# Altium project 5A.PrjPcb
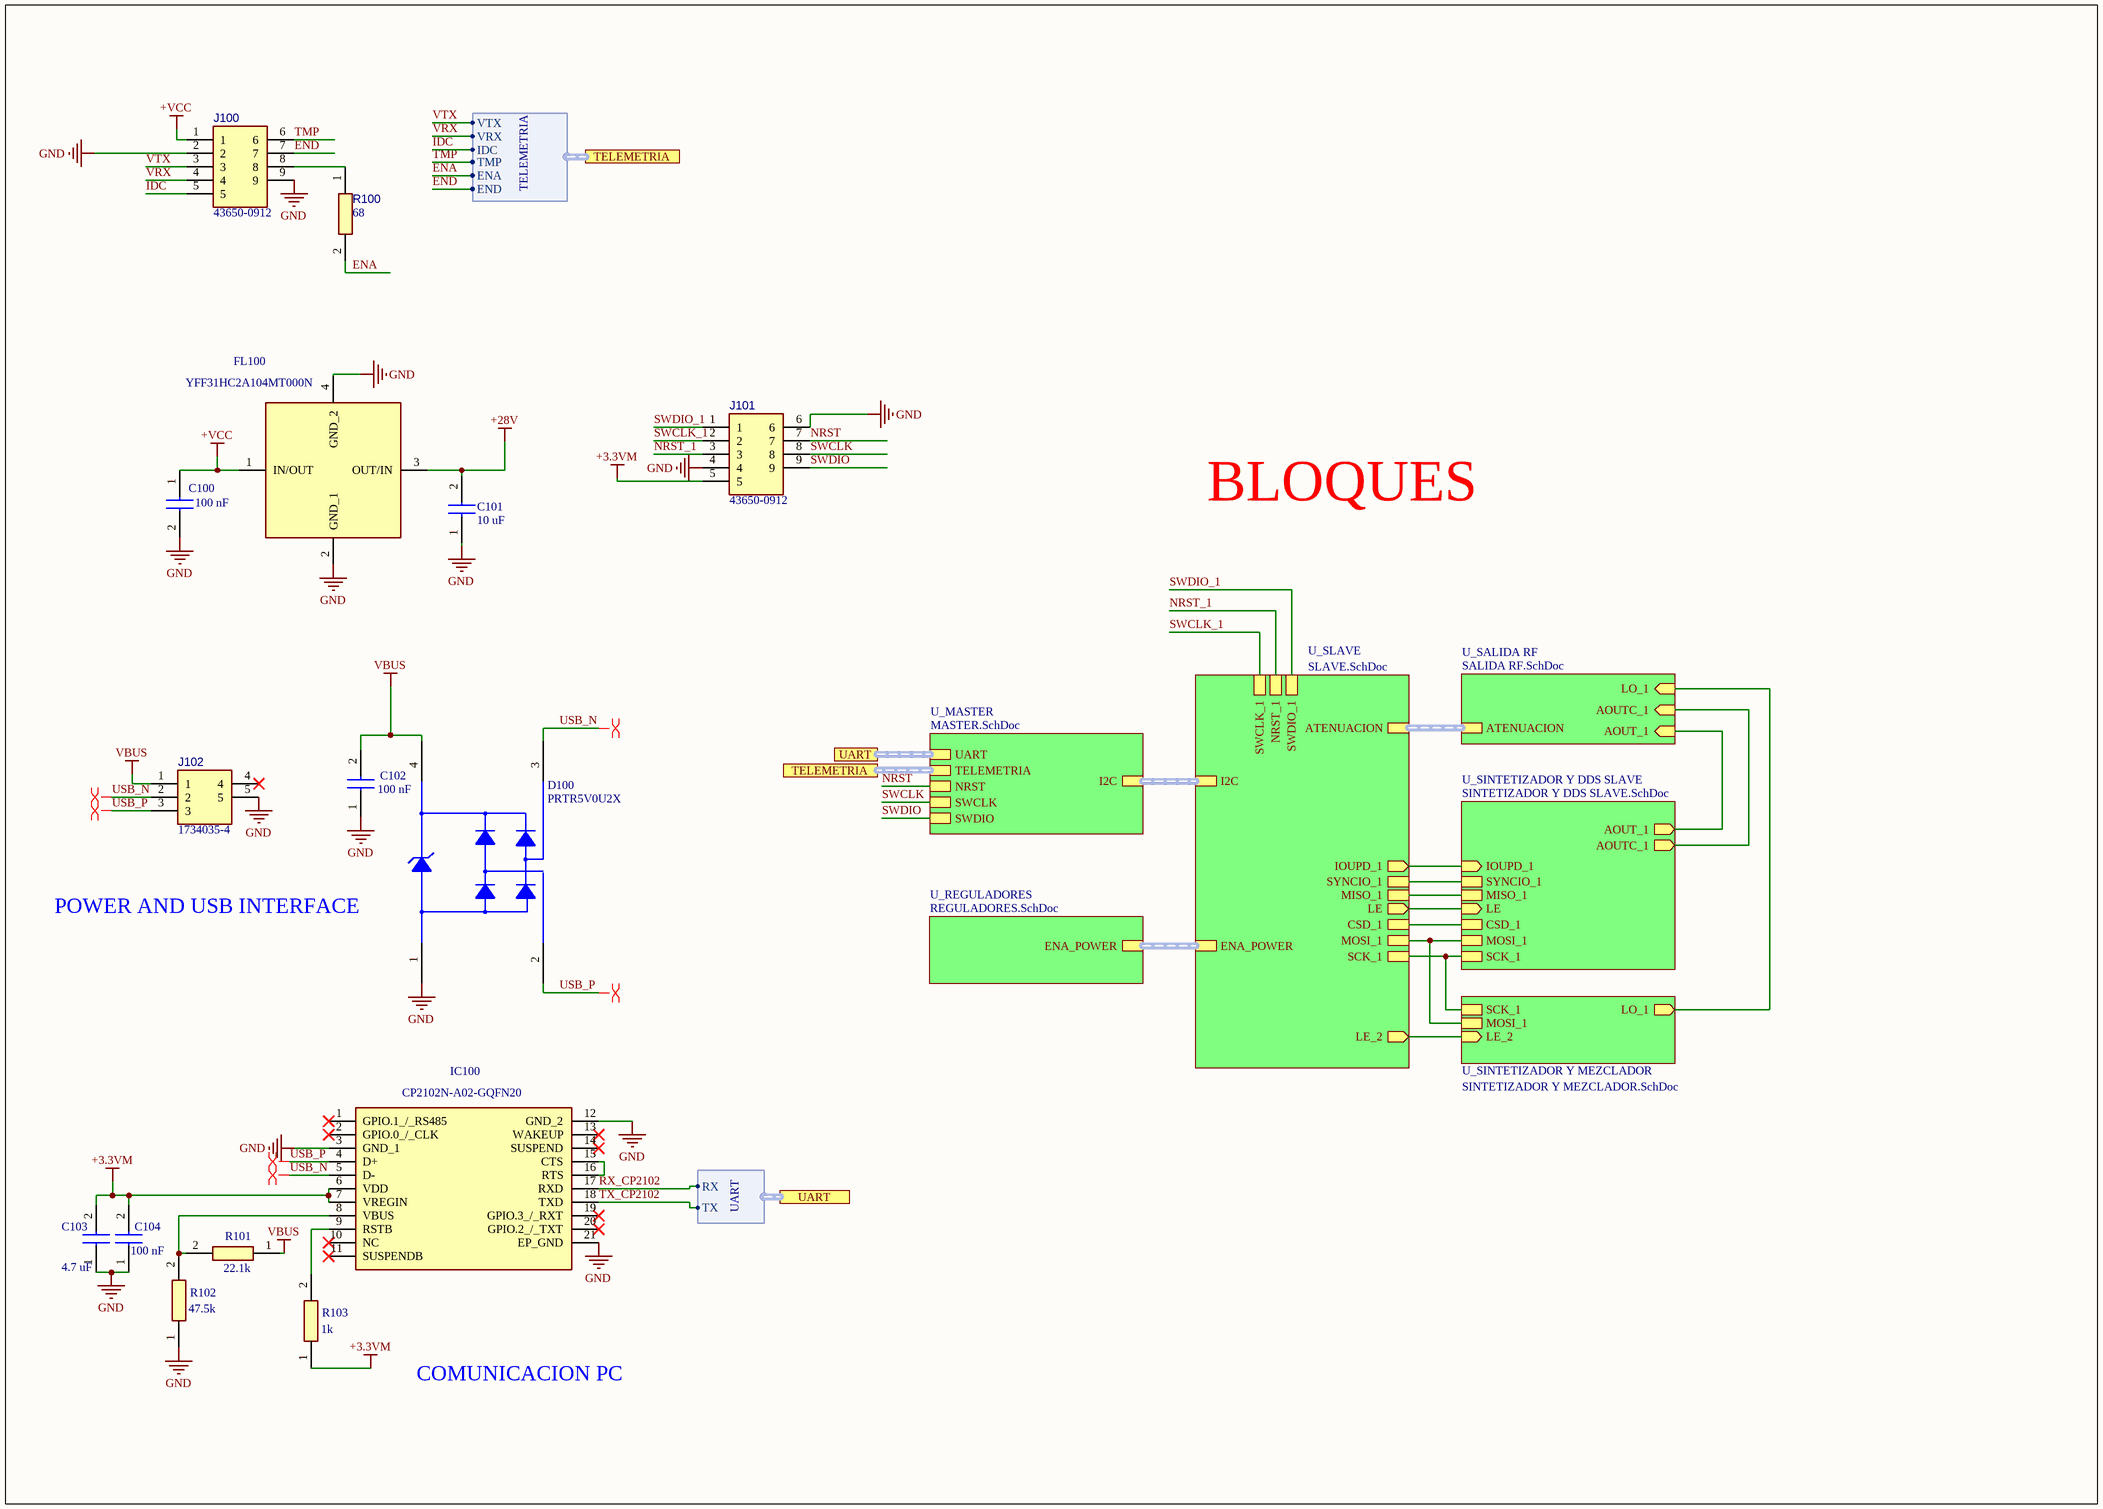
[diagram p0: GENERADORA V1.5.SchDoc]
5 sheets, 145 parts. Net scope: hierarchical (ports join the sheet entries above them; power ports are global).
Board file: GENERADORA V1.5.PcbDoc
Sheets:
  GENERADORA V1.5.SchDoc
    U_SALIDA RF = SALIDA RF.SchDoc
    U_SINTETIZADOR Y DDS SLAVE = SINTETIZADOR Y DDS SLAVE.SchDoc
    U_SINTETIZADOR Y MEZCLADOR = SINTETIZADOR Y MEZCLADOR.SchDoc
    U_SLAVE = SLAVE.SchDoc

## Sheet GENERADORA V1.5.SchDoc
size A3; SheetNumber: 1; SheetTotal: 7

### Parts
C100  100 nF  [CAPC3216X94N]
C101  10 uF  [CAPC3216X94N]
C102  100 nF  [CAPC3216X94N]
C103  4.7 uF  [C0603]
C104  100 nF  [C0603]
D100  PRTR5V0U2X  [AP4-00001]
FL100  YFF31HC2A104MT000N  [YFF31HC2A104MT000N]
IC100  CP2102N-A02-GQFN20  [CP2102NA02GQFN20]
J100  43650-0912  [43650-09(12,13,14)]
J101  43650-0912  [43650-09(12,13,14)]
J102  1734035-4  [1734035-2USB]
R100  68  [RESC1608X55N]
R101  22.1k  [RESC1608X55N]
R102  47.5k  [RESC1608X55N]
R103  1k  [RESC1608X55N]

### Sub-sheets
U_MASTER = MASTER.SchDoc (file not in this document): I2C (harness I2C), UART (harness UART), TELEMETRIA (harness TELEMETRIA), NRST, SWCLK, SWDIO
U_REGULADORES = REGULADORES.SchDoc (file not in this document): ENA_POWER (harness ENA_POWER)
U_SALIDA RF = SALIDA RF.SchDoc: LO_1 (in), AOUTC_1 (in), AOUT_1 (in), ATENUACION (harness ATENUACION)
U_SINTETIZADOR Y DDS SLAVE = SINTETIZADOR Y DDS SLAVE.SchDoc: AOUTC_1 (out), AOUT_1 (out), CSD_1, SCK_1, MISO_1, SYNCIO_1, MOSI_1, LE (in), IOUPD_1 (in)
U_SINTETIZADOR Y MEZCLADOR = SINTETIZADOR Y MEZCLADOR.SchDoc: SCK_1, MOSI_1, LE_2 (in), LO_1 (out)
U_SLAVE = SLAVE.SchDoc: IOUPD_1 (out), LE (out), LE_2 (out), I2C (harness I2C), ATENUACION (harness ATENUACION), SWCLK_1, SWDIO_1, NRST_1, ENA_POWER (harness ENA_POWER), CSD_1, MISO_1, MOSI_1, SCK_1, SYNCIO_1

### Ports
TELEMETRIA (harness TELEMETRIA), UART (harness TELEMETRIA), UART (harness UART)

### Harnesses
UART: RX, TX
TELEMETRIA: VTX, VRX, IDC, TMP, ENA, END

### Nets
+3.3VM: C103.2 C104.2 IC100.6(VDD) IC100.7(VREGIN) J101.5 R103.1
+28V: C101.2 FL100.3(OUT/IN)
+VCC: C100.1 FL100.1(IN/OUT) J100.1
GND: C100.2 C101.1 C102.1 C103.1 C104.1 D100.1(GND) FL100.2(GND_1) FL100.4(GND_2) IC100.3(GND_1) IC100.12(GND_2) IC100.21(EP_GND) J100.2 J100.9 J101.4 J101.6 J102.5 R102.1
VBUS: C102.2 D100.4(VCC) J102.1 R101.1
AOUT_1: sheet U_SALIDA RF/AOUT_1, sheet U_SINTETIZADOR Y DDS SLAVE/AOUT_1
AOUTC_1: sheet U_SALIDA RF/AOUTC_1, sheet U_SINTETIZADOR Y DDS SLAVE/AOUTC_1
CSD_1: sheet U_SINTETIZADOR Y DDS SLAVE/CSD_1, sheet U_SLAVE/CSD_1
ENA: R100.2 ; port TELEMETRIA.ENA
END: J100.7 ; port TELEMETRIA.END
IDC: J100.5 ; port TELEMETRIA.IDC
IOUPD_1: sheet U_SINTETIZADOR Y DDS SLAVE/IOUPD_1, sheet U_SLAVE/IOUPD_1
LE: sheet U_SINTETIZADOR Y DDS SLAVE/LE, sheet U_SLAVE/LE
LE_2: sheet U_SINTETIZADOR Y MEZCLADOR/LE_2, sheet U_SLAVE/LE_2
MISO_1: sheet U_SINTETIZADOR Y DDS SLAVE/MISO_1, sheet U_SLAVE/MISO_1
MOSI_1: sheet U_SINTETIZADOR Y DDS SLAVE/MOSI_1, sheet U_SINTETIZADOR Y MEZCLADOR/MOSI_1, sheet U_SLAVE/MOSI_1
NRST: J101.7 ; sheet U_MASTER/NRST
NRST_1: J101.3 ; sheet U_SLAVE/NRST_1
RX_CP2102: IC100.17(RXD) ; port UART.RX
SCK_1: sheet U_SINTETIZADOR Y DDS SLAVE/SCK_1, sheet U_SINTETIZADOR Y MEZCLADOR/SCK_1, sheet U_SLAVE/SCK_1
SWCLK: J101.8 ; sheet U_MASTER/SWCLK
SWCLK_1: J101.2 ; sheet U_SLAVE/SWCLK_1
SWDIO: J101.9 ; sheet U_MASTER/SWDIO
SWDIO_1: J101.1 ; sheet U_SLAVE/SWDIO_1
SYNCIO_1: sheet U_SINTETIZADOR Y DDS SLAVE/SYNCIO_1, sheet U_SLAVE/SYNCIO_1
TMP: J100.6 ; port TELEMETRIA.TMP
TX_CP2102: IC100.18(TXD) ; port UART.TX
USB_N: D100.3(I/O_2) IC100.5(D-) J102.2
USB_P: D100.2(I/O_1) IC100.4(D+) J102.3
VRX: J100.4 ; port TELEMETRIA.VRX
VTX: J100.3 ; port TELEMETRIA.VTX
NetC619_1: sheet U_SALIDA RF/LO_1, sheet U_SINTETIZADOR Y MEZCLADOR/LO_1
NetIC100_8: IC100.8(VBUS) R101.2 R102.2
NetIC100_9: IC100.9(RSTB) R103.2
NetIC100_15: IC100.15(CTS) IC100.16(RTS)
NetJ100_8: J100.8 R100.1

Not connected (* = marked no-connect by the designer): IC100 1(GPIO.1_/_RS485)* 2(GPIO.0_/_CLK)* 10(NC)* 11(SUSPENDB)* 13(WAKEUP)* 14(SUSPEND)* 19(GPIO.3_/_RXT)* 20(GPIO.2_/_TXT)*; J102 4*

### Buses and harness runs
harness port TELEMETRIA = sheet U_MASTER/TELEMETRIA
harness port UART = sheet U_MASTER/UART
harness sheet U_MASTER/I2C = sheet U_SLAVE/I2C
harness sheet U_REGULADORES/ENA_POWER = sheet U_SLAVE/ENA_POWER
harness sheet U_SALIDA RF/ATENUACION = sheet U_SLAVE/ATENUACION

### Layout directives
differential pair; differential pair class USB: USB_N, USB_P

### Notes on the sheet
- BLOQUES
- POWER AND USB INTERFACE
- COMUNICACION PC

### Library data of the parts
C100-C102 = KAM31BR81H103KT: Capacitor; Manufacturer_Name: KYOCERA; Datasheet Link: https://datasheets.kyocera-avx.com/AutoMLCCKAM.pdf; Height: 0.94mm; Manufacturer_Part_Number: KAM31BR81H103KT; Mouser Part Number: 581-KAM31BR81H103KT; Mouser Price/Stock: https://www.mouser.co.uk/ProductDetail/KYOCERA-AVX/KAM31BR81H103KT?qs=Jm2GQyTW%2FbjzijSUJGW%2FJA%3D%3D
C103 C104 = C0603H470J5GACTU: Capacitor; Manufacturer_Name: KEMET; Datasheet Link: https://content.kemet.com/datasheets/KEM_C1001_C0G_200C_SMD.pdf; Height: 0.87mm; Manufacturer_Part_Number: C0603H470J5GACTU
D100 = PRTR5V0U2X: Double rail-to-rail USB ESD protection diode; OrcadPartType: Integrated Circuits&Special function&Protection; Manufacturer: Philips; AN: A06-0236; TemperatureRange: -40 to +85 C; Value: PRTR5V0U2X; PartType: Buy; Height: 1,10000002384186; MPN: PRTR5V0U2X
FL100 = YFF31HC2A104MT000N: Filter; Manufacturer_Name: TDK; Datasheet Link: https://product.tdk.com/system/files/dam/doc/product/emc/emc/3tf/catalog/3tf_commercial_power_yff-hc_en.pdf; Height: 1.5mm; Manufacturer_Part_Number: YFF31HC2A104MT000N; Mouser Part Number: 810-YFF31HC2A104MTHN; Mouser Price/Stock: https://www.mouser.co.uk/ProductDetail/TDK/YFF31HC2A104MT000N?qs=1gGcJ6gR7Y2xnDLNcVCkdg%3D%3D; Arrow Part Number: YFF31HC2A104MT000N; Arrow Price/Stock: https://www.arrow.com/en/products/yff31hc2a104mt000n/tdk?region=nac
IC100 = CP2102N-A02-GQFN20: Integrated Circuit; Manufacturer_Name: Silicon Labs; Datasheet Link: https://www.silabs.com/documents/public/data-sheets/cp2102n-datasheet.pdf; Height: 0.8mm; Manufacturer_Part_Number: CP2102N-A02-GQFN20; Mouser Part Number: 634-CP2102NA02GQFN20; Mouser Price/Stock: https://www.mouser.co.uk/ProductDetail/Silicon-Labs/CP2102N-A02-GQFN20?qs=u16ybLDytRaG8WdlP0fT2g%3D%3D; Arrow Part Number: CP2102N-A02-GQFN20; Arrow Price/Stock: https://www.arrow.com/en/products/cp2102n-a02-gqfn20/silicon-labs?region=europe
J100 J101 = 43650-0912: Connector; Manufacturer_Name: Molex; Datasheet Link: https://www.molex.com/pdm_docs/sd/436500212_sd.pdf; Height: 5.57mm; Manufacturer_Part_Number: 43650-0912; Mouser Part Number: 538-43650-0912; Mouser Price/Stock: https://www.mouser.co.uk/ProductDetail/Molex/43650-0912?qs=lm8WgJiVcEuC1RHlaQB4sg%3D%3D
J102 = 1734035-4: Connector; Manufacturer_Name: TE Connectivity; Datasheet Link: http://www.te.com/commerce/DocumentDelivery/DDEController?Action=srchrtrv&DocNm=1734035&DocType=Customer+Drawing&DocLang=English&DocFormat=pdf&PartCntxt=1734035-4; Manufacturer_Part_Number: 1734035-4; Mouser Part Number: 571-1734035-4; Mouser Price/Stock: https://www.mouser.co.uk/ProductDetail/TE-Connectivity/1734035-4?qs=ZYpP4JSRRNCyjylIh5thIQ%3D%3D; Arrow Part Number: 1734035-4; Arrow Price/Stock: https://www.arrow.com/en/products/1734035-4/te-connectivity?region=nac
R100-R103 = CR0603-FX-1431ELF: Resistor; Manufacturer_Name: Bourns; Datasheet Link: https://www.bourns.com/pdfs/chpreztr.pdf; Height: 0.55mm; Manufacturer_Part_Number: CR0603-FX-1431ELF; Mouser Part Number: 652-CR0603FX-1431ELF; Mouser Price/Stock: https://www.mouser.co.uk/ProductDetail/Bourns/CR0603-FX-1431ELF?qs=e7cxVwPieurCzASkAzK2%252Bg%3D%3D

## Sheet SALIDA RF.SchDoc
size A3; SheetNumber: 7; SheetTotal: 7
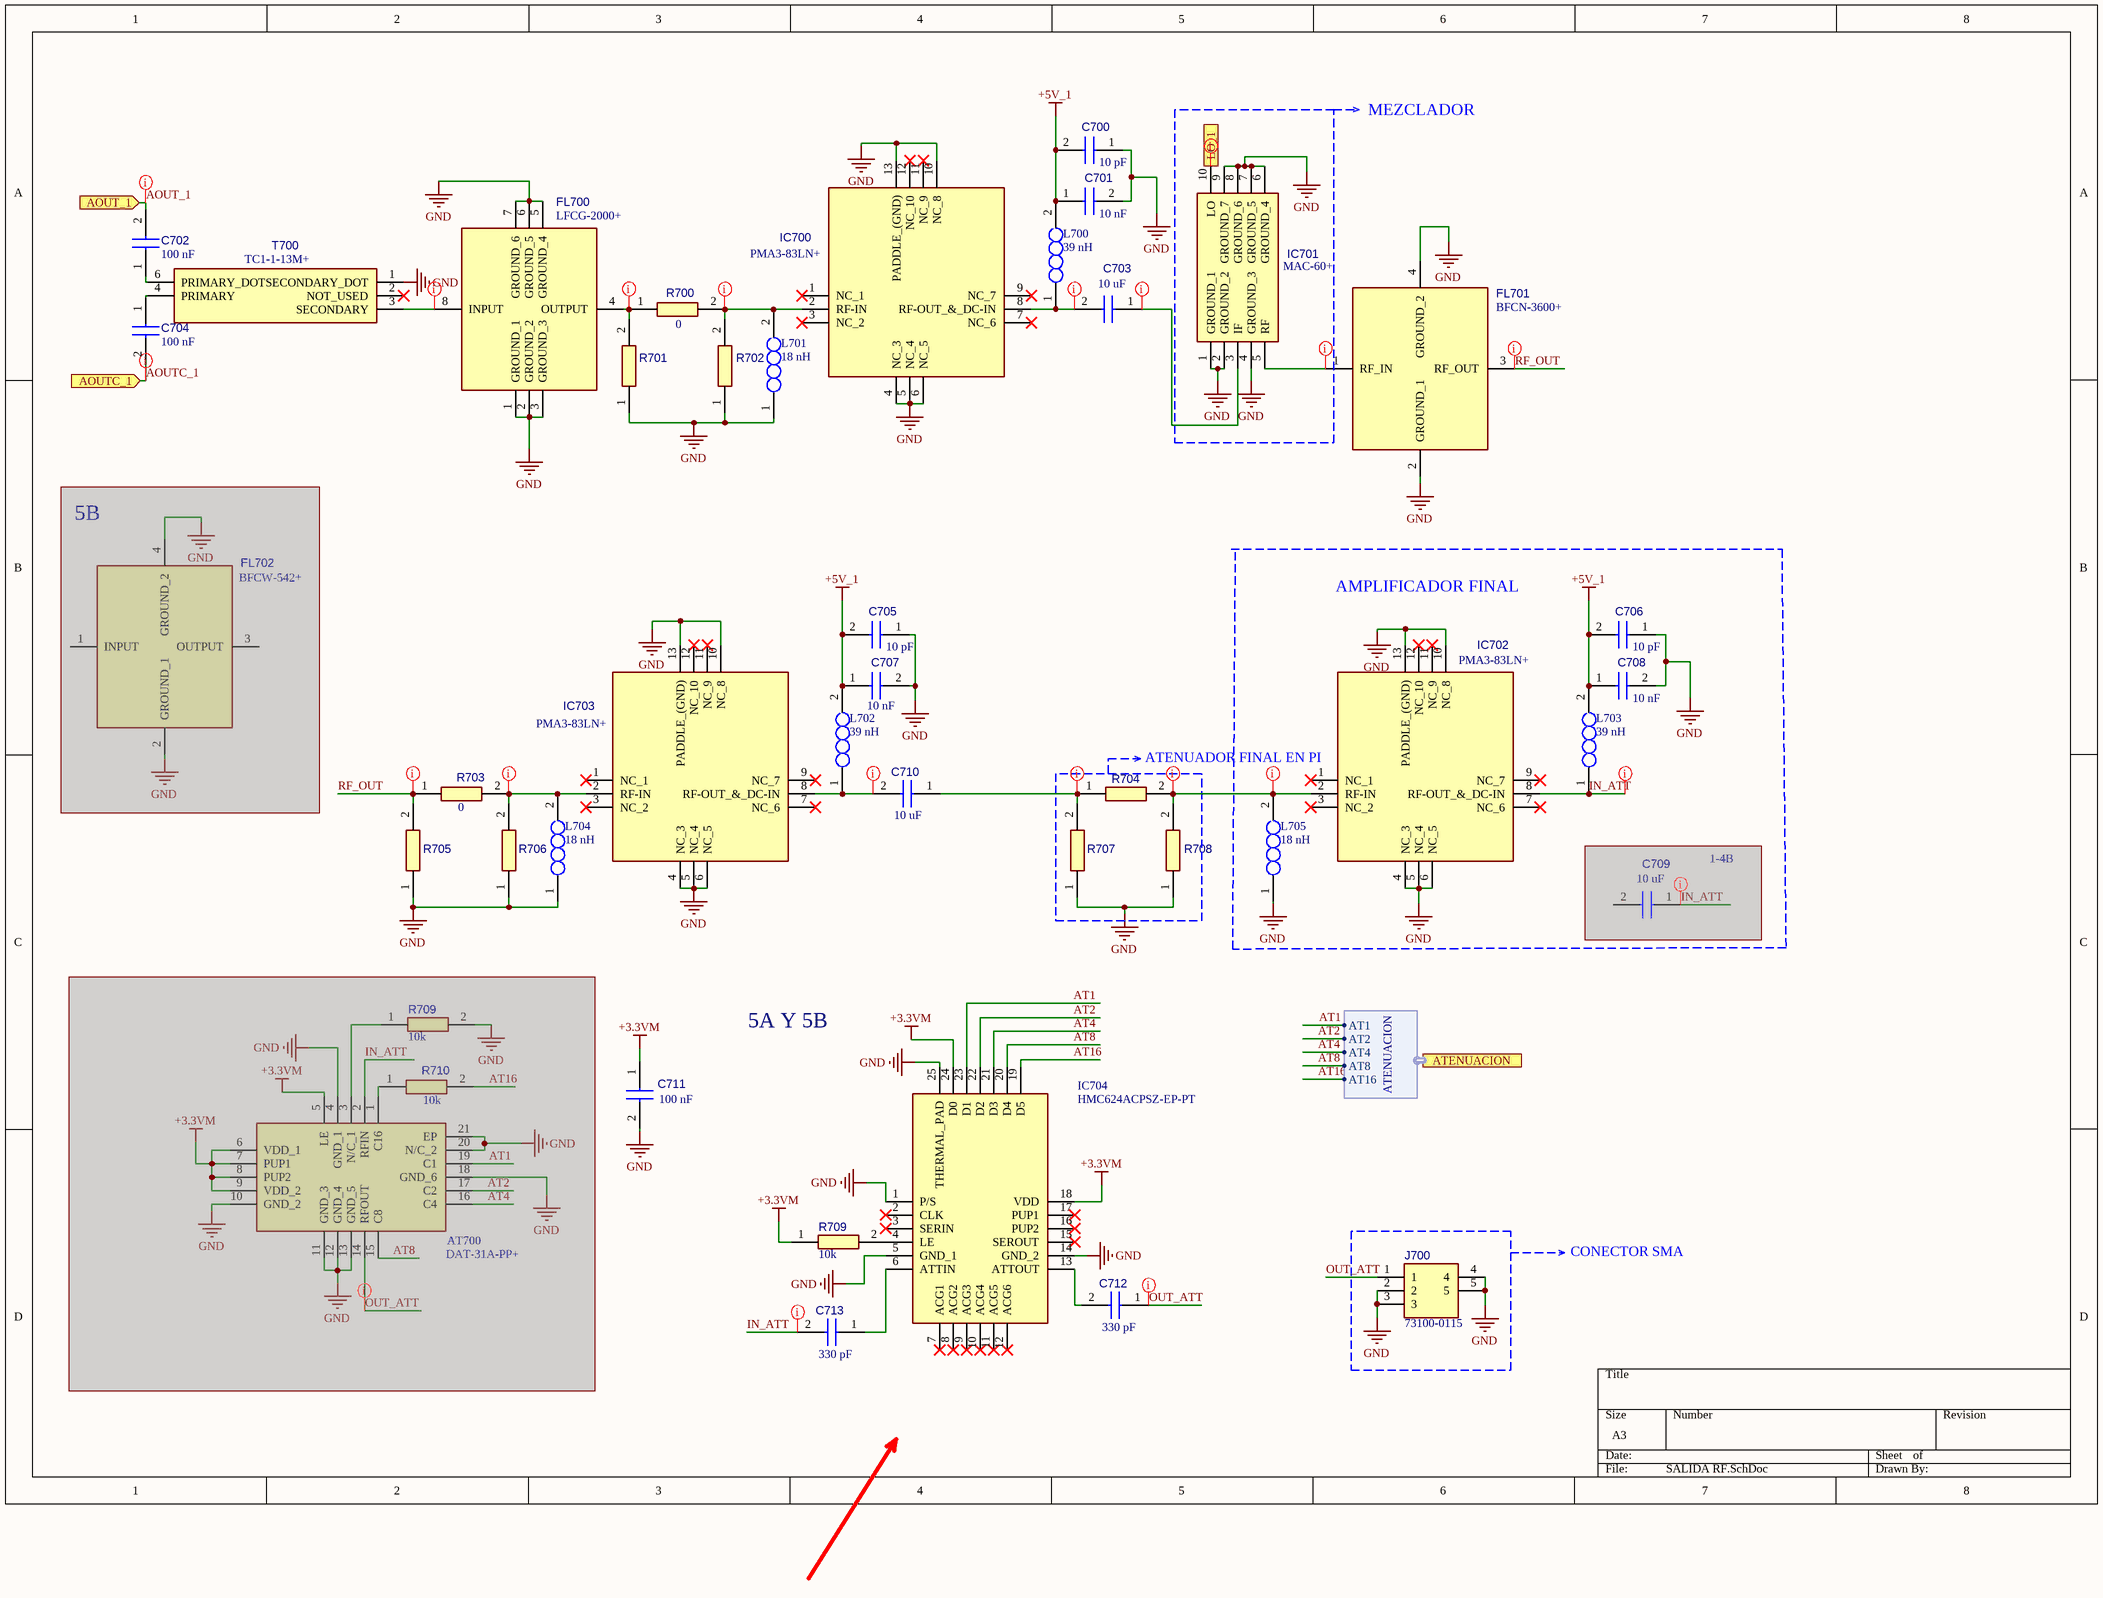
[diagram p1: SALIDA RF.SchDoc]

### Parts
(Parts that share a designator on the sheet are numbered #1, #2 ... from top to bottom, then left to right.)
AT700  DAT-31A-PP+  [QFN50P400X400X85-21N]  (masked out: inside a compile mask, not in the netlist)
C700  10 pF  [C0603]
C701  10 nF  [C0603]
C702  100 nF  [C0603]
C703  10 uF  [C0603]
C704  100 nF  [C0603]
C705  10 pF  [C0603]
C706  10 pF  [C0603]
C707  10 nF  [C0603]
C708  10 nF  [C0603]
C709  10 uF  [C0603]  (masked out: inside a compile mask, not in the netlist)
C710  10 uF  [C0603]
C711  100 nF  [C0603]
C712  330 pF  [C0603]
C713  330 pF  [C0603]
FL700  LFCG-2000+  [LFCG2000]
FL701  BFCN-3600+  [BFCN2435]
FL702  BFCW-542+  [BFCW542]  (masked out: inside a compile mask, not in the netlist)
IC700  PMA3-83LN+  [QFN51P300X300X89-13N]
IC701  MAC-60+  [MAC42]
IC702  PMA3-83LN+  [QFN51P300X300X89-13N]
IC703  PMA3-83LN+  [QFN51P300X300X89-13N]
IC704  HMC624ACPSZ-EP-PT  [QFN50P400X400X90-25N-D]
J700  73100-0115  [731000115]
L700  39 nH  [INDC1608X95N]
L701  18 nH  [INDC1608X95N]
L702  39 nH  [INDC1608X95N]
L703  39 nH  [INDC1608X95N]
L704  18 nH  [INDC1608X95N]
L705  18 nH  [INDC1608X95N]
R700  0  [RESC1608X55N]
R701  68  [RESC1608X55N]  (value not drawn)
R702  68  [RESC1608X55N]  (value not drawn)
R703  0  [RESC1608X55N]
R704  0  [RESC1608X55N]  (value not drawn)
R705  68  [RESC1608X55N]  (value not drawn)
R706  68  [RESC1608X55N]  (value not drawn)
R707  'NO SOLDAR (HAY QUE AJUSTAR)  [RESC1608X55N]  (value not drawn)
R708  'NO SOLDAR (HAY QUE AJUSTAR)  [RESC1608X55N]  (value not drawn)
R709#1  10k  [RESC1608X55N]  (masked out: inside a compile mask, not in the netlist)
R709#2  10k  [RESC1608X55N]
R710  10k  [RESC1608X55N]  (masked out: inside a compile mask, not in the netlist)
T700  TC1-1-13M+  [TC414]

### Blocks framed on the sheet
ATENUADOR FINAL EN PI: R704 R707 R708

### Ports
AOUT_1 (in), AOUTC_1 (in), ATENUACION (harness ATENUACION), LO_1 (in)

### Harnesses
ATENUACION: AT1, AT2, AT4, AT8, AT16

### Nets
+3.3VM: C711.1 IC704.18(VDD) IC704.24(D0) R709#2.1
+5V_1: C700.2 C701.1 C705.2 C706.2 C707.1 C708.1 L700.2 L702.2 L703.2
GND: C700.1 C701.2 C705.1 C706.1 C707.2 C708.2 C711.2 FL700.1(GROUND_1) FL700.2(GROUND_2) FL700.3(GROUND_3) FL700.5(GROUND_4) FL700.6(GROUND_5) FL700.7(GROUND_6) FL701.2(GROUND_1) FL701.4(GROUND_2) IC700.4(NC_3) IC700.5(NC_4) IC700.6(NC_5) IC700.10(NC_8) IC700.13(PADDLE_(GND)) IC701.1(GROUND_1) IC701.2(GROUND_2) IC701.4(GROUND_3) IC701.6(GROUND_4) IC701.7(GROUND_5) IC701.8(GROUND_6) IC701.9(GROUND_7) IC702.4(NC_3) IC702.5(NC_4) IC702.6(NC_5) IC702.10(NC_8) IC702.13(PADDLE_(GND)) IC703.4(NC_3) IC703.5(NC_4) IC703.6(NC_5) IC703.10(NC_8) IC703.13(PADDLE_(GND)) IC704.1(P/S) IC704.5(GND_1) IC704.14(GND_2) IC704.25(THERMAL_PAD) J700.2 J700.3 J700.4 J700.5 L701.1 L704.1 L705.1 R701.1 R702.1 R705.1 R706.1 R707.1 R708.1 T700.1(SECONDARY_DOT)
AOUT_1: C702.2 ; port AOUT_1
AOUTC_1: C704.2 ; port AOUTC_1
AT1: IC704.23(D1) ; port ATENUACION.AT1
AT2: IC704.22(D2) ; port ATENUACION.AT2
AT4: IC704.21(D3) ; port ATENUACION.AT4
AT8: IC704.20(D4) ; port ATENUACION.AT8
AT16: IC704.19(D5) ; port ATENUACION.AT16
IN_ATT: C713.2 IC702.8(RF-OUT_&_DC-IN) L703.1
OUT_ATT: C712.1 J700.1
RF_OUT: FL701.3(RF_OUT) R703.1 R705.2
NetC619_1: IC701.10(LO) ; port LO_1
NetC702_1: C702.1 T700.6(PRIMARY_DOT)
NetC703_1: C703.1 IC701.3(IF)
NetC703_2: C703.2 IC700.8(RF-OUT_&_DC-IN) L700.1
NetC704_1: C704.1 T700.4(PRIMARY)
NetC710_1: C710.1 R704.1 R707.2
NetC710_2: C710.2 IC703.8(RF-OUT_&_DC-IN) L702.1
NetC712_2: C712.2 IC704.13(ATTOUT)
NetC713_1: C713.1 IC704.6(ATTIN)
NetFL700_4: FL700.4(OUTPUT) R700.1 R701.2
NetFL700_8: FL700.8(INPUT) T700.3(SECONDARY)
NetFL701_1: FL701.1(RF_IN) IC701.5(RF)
NetIC700_2: IC700.2(RF-IN) L701.2 R700.2 R702.2
NetIC702_2: IC702.2(RF-IN) L705.2 R704.2 R708.2
NetIC703_2: IC703.2(RF-IN) L704.2 R703.2 R706.2
NetIC704_4: IC704.4(LE) R709#2.2

Not connected (* = marked no-connect by the designer): IC700 1(NC_1)* 3(NC_2)* 7(NC_6)* 9(NC_7)* 11(NC_9)* 12(NC_10)*; IC702 1(NC_1)* 3(NC_2)* 7(NC_6)* 9(NC_7)* 11(NC_9)* 12(NC_10)*; IC703 1(NC_1)* 3(NC_2)* 7(NC_6)* 9(NC_7)* 11(NC_9)* 12(NC_10)*; IC704 2(CLK)* 3(SERIN)* 7(ACG1)* 8(ACG2)* 9(ACG3)* 10(ACG4)* 11(ACG5)* 12(ACG6)* 15(SEROUT)* 16(PUP2)* 17(PUP1)*; T700 2(NOT_USED)*

### Layout directives
net class RF: (no net found under the mark), AOUT_1, AOUTC_1, IN_ATT, NetC619_1, NetC703_1, NetC703_2, NetC710_1, NetC710_2, NetFL700_4, NetFL700_8, NetFL701_1, NetIC700_2, NetIC702_2, NetIC703_2, OUT_ATT, RF_OUT

### Notes on the sheet
- MEZCLADOR
- (near FL702) 5B
- AMPLIFICADOR FINAL
- 1-4B
- 5A Y 5B
- CONECTOR SMA

### Library data of the parts
AT700 = DAT-31A-PP+: Attenuator or Isolator; Manufacturer_Name: Mini-Circuits; Datasheet Link: https://www.minicircuits.com/pdfs/DAT-31A-PP+.pdf; Height: 0.85mm; Manufacturer_Part_Number: DAT-31A-PP+; Mouser Part Number: 139-DAT-31A-PP+; Mouser Price/Stock: https://www.mouser.co.uk/ProductDetail/Mini-Circuits/DAT-31A-PP%2b?qs=iLbezkQI%252BsipsaaDf6EyAg%3D%3D
C700-C713 = C0603H470J5GACTU: Capacitor; Manufacturer_Name: KEMET; Datasheet Link: https://content.kemet.com/datasheets/KEM_C1001_C0G_200C_SMD.pdf; Height: 0.87mm; Manufacturer_Part_Number: C0603H470J5GACTU
FL700 = LFCG-2000+: Filter; Manufacturer_Name: Mini-Circuits; Datasheet Link: https://www.minicircuits.com/WebStore/dashboardPdf?model=LFCG-2000%2B; Height: 0.95mm; Manufacturer_Part_Number: LFCG-2000+; Mouser Part Number: 139-LFCG-2000+; Mouser Price/Stock: https://www.mouser.co.uk/ProductDetail/Mini-Circuits/LFCG-2000%2b?qs=DRkmTr78QATAEe9U%2FxoX1Q%3D%3D
FL701 = BFCN-2435+: Filter; Manufacturer_Name: Mini-Circuits; Datasheet Link: https://www.minicircuits.com/pdfs/BFCN-2435+.pdf; Height: 0.94mm; Manufacturer_Part_Number: BFCN-2435+; Mouser Part Number: 139-BFCN-2435; Mouser Price/Stock: https://www.mouser.co.uk/ProductDetail/Mini-Circuits/BFCN-2435%2b?qs=xZ%2FP%252Ba9zWqYYr0O8v0NpTg%3D%3D
FL702 = BFCW-542+: Filter; Manufacturer_Name: Mini-Circuits; Datasheet Link: https://www.minicircuits.com/pdfs/BFCW-542+.pdf; Height: 0.61mm; Manufacturer_Part_Number: BFCW-542+; Mouser Part Number: 139-BFCW-542; Mouser Price/Stock: https://www.mouser.co.uk/ProductDetail/Mini-Circuits/BFCW-542%2b?qs=xZ%2FP%252Ba9zWqZdnlamFpkC0g%3D%3D
IC700 IC702 IC703 = PMA3-83LN+: Integrated Circuit; Manufacturer_Name: Mini-Circuits; Datasheet Link: https://www.minicircuits.com/pdfs/PMA3-83LN+.pdf; Height: 0.89mm; Manufacturer_Part_Number: PMA3-83LN+; Mouser Part Number: 139-PMA3-83LN; Mouser Price/Stock: https://www.mouser.co.uk/ProductDetail/Mini-Circuits/PMA3-83LN%2b?qs=xZ%2FP%252Ba9zWqbScBj7fhbP6Q%3D%3D
IC701 = MAC-42+: Integrated Circuit; Manufacturer_Name: Mini-Circuits; Datasheet Link: https://www.minicircuits.com/WebStore/dashboardPdf?model=MAC-42%2B; Height: 1.52mm; Manufacturer_Part_Number: MAC-42+; Mouser Part Number: 139-MAC-42+; Mouser Price/Stock: https://www.mouser.co.uk/ProductDetail/Mini-Circuits/MAC-42%2b?qs=Imq1NPwxi74M3vy8bL9AzQ%3D%3D
IC704 = HMC624ACPSZ-EP-PT: Integrated Circuit; Manufacturer_Name: Analog Devices; Datasheet Link: https://www.analog.com/HMC624A/datasheet; Height: 0.9mm; Manufacturer_Part_Number: HMC624ACPSZ-EP-PT; Mouser Part Number: 584-HM624ACPSZ-EP-PT; Mouser Price/Stock: https://www.mouser.co.uk/ProductDetail/Analog-Devices/HMC624ACPSZ-EP-PT?qs=BZBei1rCqCDRspZheXUYqA%3D%3D; Arrow Part Number: HMC624ACPSZ-EP-PT; Arrow Price/Stock: https://www.arrow.com/en/products/hmc624acpsz-ep-pt/analog-devices
J700 = 73100-0115: Connector; Manufacturer_Name: Molex; Datasheet Link: https://www.molex.com/pdm_docs/sd/731000115_sd.pdf; Height: 9.57mm; Manufacturer_Part_Number: 73100-0115; Mouser Part Number: 538-73100-0115; Mouser Price/Stock: https://www.mouser.co.uk/ProductDetail/Molex/73100-0115?qs=dxVETAvtHz69wpck%252B7ItSw%3D%3D
L700-L705 = AIML-0603-100K-T: Inductor; Manufacturer_Name: ABRACON; Datasheet Link: https://abracon.com/Magnetics/new/AIML-0603.pdf; Height: 0.95mm; Manufacturer_Part_Number: AIML-0603-100K-T; Mouser Part Number: 815-AIML-0603-100KT; Mouser Price/Stock: https://www.mouser.co.uk/ProductDetail/ABRACON/AIML-0603-100K-T?qs=1vO2EIVe%252BY5tBY%252BpVVThrw%3D%3D; Arrow Part Number: AIML-0603-100K-T; Arrow Price/Stock: https://www.arrow.com/en/products/aiml-0603-100k-t/abracon?region=nac
R700 R702-R708 R709#1 R709#2 R710 = CR0603-FX-1431ELF: Resistor; Manufacturer_Name: Bourns; Datasheet Link: https://www.bourns.com/pdfs/chpreztr.pdf; Height: 0.55mm; Manufacturer_Part_Number: CR0603-FX-1431ELF; Mouser Part Number: 652-CR0603FX-1431ELF; Mouser Price/Stock: https://www.mouser.co.uk/ProductDetail/Bourns/CR0603-FX-1431ELF?qs=e7cxVwPieurCzASkAzK2%252Bg%3D%3D
R701 = CR0603-FX-1431ELF: Manufacturer_Name: Bourns; Datasheet Link: https://www.bourns.com/pdfs/chpreztr.pdf; Height: 0.55mm; Manufacturer_Part_Number: CR0603-FX-1431ELF; Mouser Part Number: 652-CR0603FX-1431ELF; Mouser Price/Stock: https://www.mouser.co.uk/ProductDetail/Bourns/CR0603-FX-1431ELF?qs=e7cxVwPieurCzASkAzK2%252Bg%3D%3D
T700 = TC1-1-13M+: Transformer; Manufacturer_Name: Mini-Circuits; Datasheet Link: https://datasheet.datasheetarchive.com/originals/distributors/Datasheets-28/DSA-546322.pdf; Height: 4.06mm; Manufacturer_Part_Number: TC1-1-13M+; Mouser Part Number: 139-TC1-1-13M; Mouser Price/Stock: https://www.mouser.co.uk/ProductDetail/Mini-Circuits/TC1-1-13M%2b?qs=xZ%2FP%252Ba9zWqYek%252BZGAF2fWg%3D%3D

## Sheet SINTETIZADOR Y DDS SLAVE.SchDoc
size A3; SheetNumber: 5; SheetTotal: 7
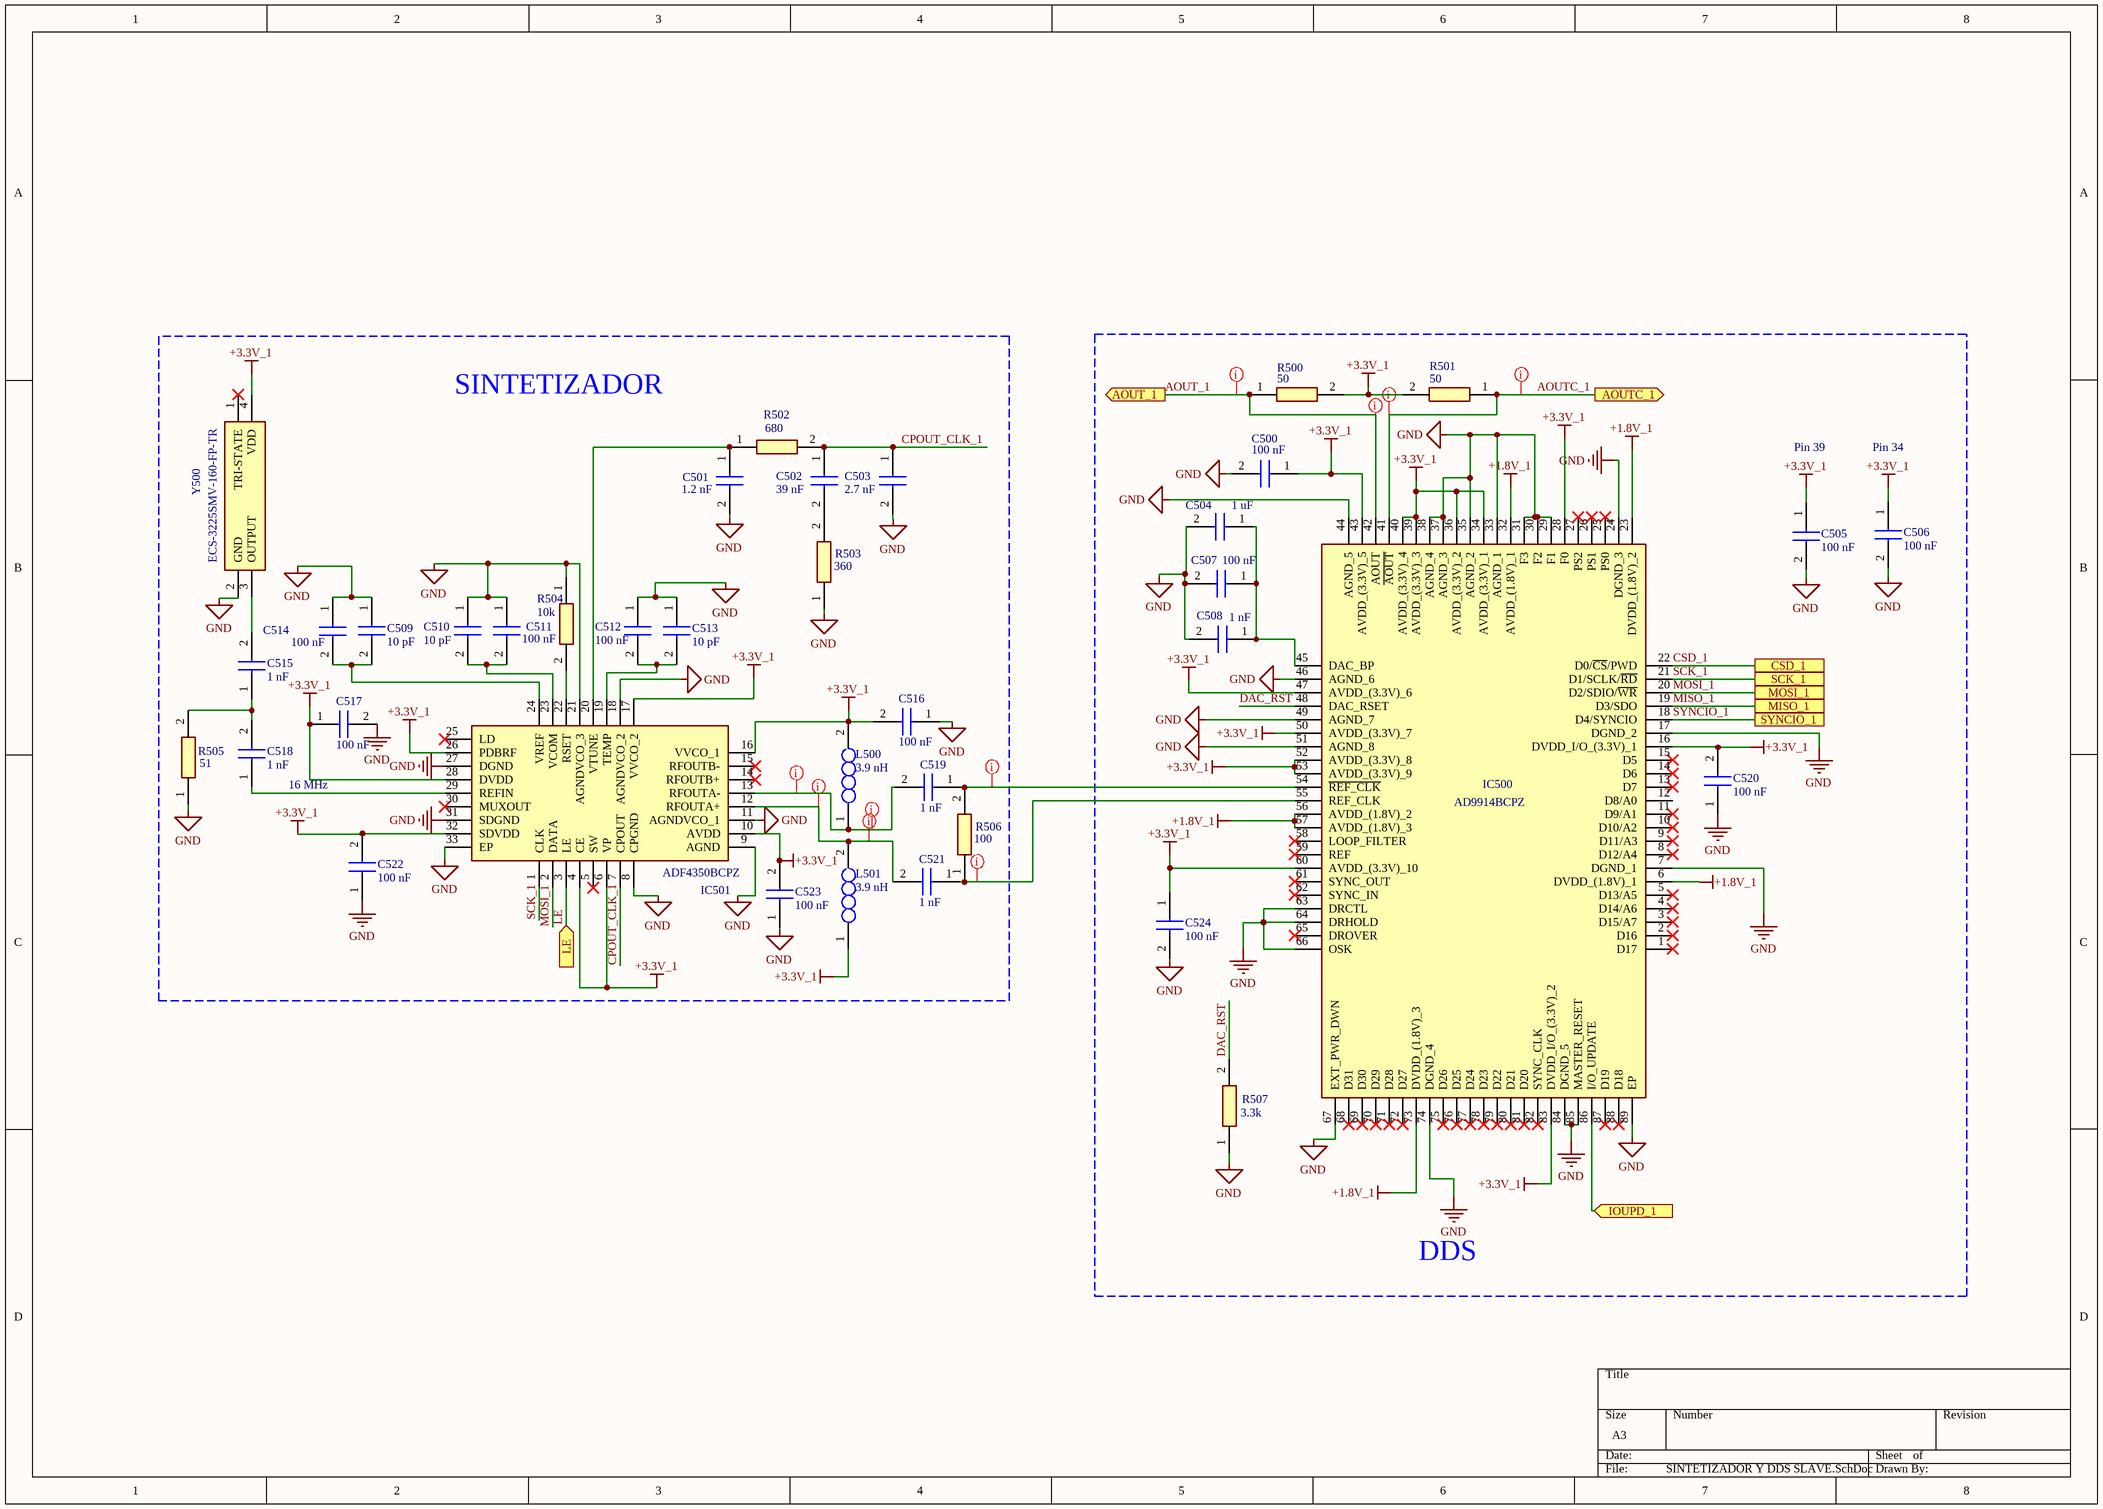
[diagram p2: SINTETIZADOR Y DDS SLAVE.SchDoc]

### Parts
C500  100 nF  [C0603]
C501  1.2 nF  [C0603]
C502  39 nF  [C0603]
C503  2.7 nF  [C0603]
C504  1 uF  [C0603]
C505  100 nF  [C0603]
C506  100 nF  [C0603]
C507  100 nF  [C0603]
C508  1 nF  [C0603]
C509  10 pF  [C0603]
C510  10 pF  [C0603]
C511  100 nF  [C0603]
C512  100 nF  [C0603]
C513  10 pF  [C0603]
C514  100 nF  [C0603]
C515  1 nF  [C0603]
C516  100 nF  [C0603]
C517  100 nF  [C0603]
C518  1 nF  [C0603]
C519  1 nF  [C0603]
C520  100 nF  [C0603]
C521  1 nF  [C0603]
C522  100 nF  [C0603]
C523  100 nF  [C0603]
C524  100 nF  [C0603]
IC500  AD9914BCPZ  [QFN50P1200X1200X90-89N-D]
IC501  ADF4350BCPZ  [QFN50P500X500X100-33N]
L500  3.9 nH  [INDC1608X95N]
L501  3.9 nH  [INDC1608X95N]
R500  50  [RESC1608X55N]
R501  50  [RESC1608X55N]
R502  680  [RESC1608X55N]
R503  360  [RESC1608X55N]
R504  10k  [RESC1608X55N]
R505  51  [RESC1608X55N]
R506  100  [RESC1608X55N]
R507  3.3k  [RESC1608X55N]
Y500  ECS-3225SMV-160-FP-TR  [ECS3225SMV160FPTR]

### Blocks framed on the sheet
SINTETIZADOR: C501-C503 C509-C519 C521-C523 IC501 L500 L501 R502-R506 Y500
DDS: C500 C504-C508 C520 C524 IC500 R500 R501 R507

### Ports
AOUT_1 (out), AOUTC_1 (out), CSD_1, IOUPD_1 (in), LE (in), MISO_1, MOSI_1, SCK_1, SYNCIO_1

### Nets
+1.8V_1: IC500.6(DVDD_(1.8V)_1) IC500.23(DVDD_(1.8V)_2) IC500.32(AVDD_(1.8V)_1) IC500.56(AVDD_(1.8V)_2) IC500.57(AVDD_(1.8V)_3) IC500.73(DVDD_(1.8V)_3)
+3.3V_1: C500.1 C505.1 C506.1 C516.2 C517.1 C520.2 C522.2 C523.2 C524.1 IC500.16(DVDD_I/O_(3.3V)_1) IC500.28(F0) IC500.34(AVDD_(3.3V)_1) IC500.36(AVDD_(3.3V)_2) IC500.39(AVDD_(3.3V)_3) IC500.40(AVDD_(3.3V)_4) IC500.43(AVDD_(3.3V)_5) IC500.47(AVDD_(3.3V)_6) IC500.50(AVDD_(3.3V)_7) IC500.52(AVDD_(3.3V)_8) IC500.53(AVDD_(3.3V)_9) IC500.60(AVDD_(3.3V)_10) IC500.83(DVDD_I/O_(3.3V)_2) IC501.4(CE) IC501.6(VP) IC501.10(AVDD) IC501.16(VVCO_1) IC501.17(VVCO_2) IC501.26(PDBRF) IC501.28(DVDD) IC501.32(SDVDD) L500.2 L501.1 R500.2 R501.2 Y500.4(VDD)
GND: C500.2 C501.2 C503.2 C504.2 C505.2 C506.2 C507.2 C508.2 C509.1 C510.1 C511.1 C512.1 C513.1 C514.1 C516.1 C517.2 C520.1 C522.1 C523.1 C524.2 IC500.7(DGND_1) IC500.17(DGND_2) IC500.24(DGND_3) IC500.29(F1) IC500.30(F2) IC500.31(F3) IC500.33(AGND_1) IC500.35(AGND_2) IC500.37(AGND_3) IC500.38(AGND_4) IC500.44(AGND_5) IC500.46(AGND_6) IC500.49(AGND_7) IC500.51(AGND_8) IC500.63(DRCTL) IC500.64(DRHOLD) IC500.66(OSK) IC500.67(EXT_PWR_DWN) IC500.74(DGND_4) IC500.84(DGND_5) IC500.85(MASTER_RESET) IC500.89(EP) IC501.8(CPGND) IC501.9(AGND) IC501.11(AGNDVCO_1) IC501.18(AGNDVCO_2) IC501.21(AGNDVCO_3) IC501.27(DGND) IC501.31(SDGND) IC501.33(EP) R503.1 R504.1 R505.1 R507.1 Y500.2(GND)
AOUT_1: IC500.42(AOUT) R500.1 ; port AOUT_1
AOUTC_1: IC500.41(~{AOUT}) R501.1 ; port AOUTC_1
CPOUT_CLK_1: C502.1 C503.1 IC501.7(CPOUT) R502.2
CSD_1: IC500.22(D0/~{CS}/PWD) ; port CSD_1
DAC_RST: IC500.48(DAC_RSET) R507.2
IOUPD_1: IC500.86(I/O_UPDATE) ; port IOUPD_1
LE: IC501.3(LE) ; port LE
MISO_1: IC500.19(D3/SDO) ; port MISO_1
MOSI_1: IC500.20(D2/SDIO/~{WR}) IC501.2(DATA) ; port MOSI_1
SCK_1: IC500.21(D1/SCLK/~{RD}) IC501.1(CLK) ; port SCK_1
SYNCIO_1: IC500.18(D4/SYNCIO) ; port SYNCIO_1
NetC501_1: C501.1 IC501.20(VTUNE) R502.1
NetC502_2: C502.2 R503.2
NetC504_1: C504.1 C507.1 C508.1 IC500.45(DAC_BP)
NetC509_2: C509.2 C514.2 IC501.24(VREF)
NetC510_2: C510.2 C511.2 IC501.23(VCOM)
NetC512_2: C512.2 C513.2 IC501.19(TEMP)
NetC515_1: C515.1 C518.2 R505.2
NetC515_2: C515.2 Y500.3(OUTPUT)
NetC518_1: C518.1 IC501.29(REFIN)
NetC519_1: C519.1 IC500.54(~{REF_CLK}) R506.2
NetC519_2: C519.2 IC501.13(RFOUTA-) L500.1
NetC521_1: C521.1 IC500.55(REF_CLK) R506.1
NetC521_2: C521.2 IC501.12(RFOUTA+) L501.2
NetIC501_22: IC501.22(RSET) R504.2

Not connected (* = marked no-connect by the designer): IC500 1(D17)* 2(D16)* 3(D15/A7)* 4(D14/A6)* 5(D13/A5)* 8(D12/A4)* 9(D11/A3)* 10(D10/A2)* 11(D9/A1)* 12(D8/A0) 13(D7)* 14(D6)* 15(D5)* 25(PS0)* 26(PS1)* 27(PS2)* 58(LOOP_FILTER)* 59(REF)* 61(SYNC_OUT)* 62(SYNC_IN)* 65(DROVER)* 68(D31)* 69(D30)* 70(D29)* 71(D28)* 72(D27)* 75(D26)* 76(D25)* 77(D24)* 78(D23)* 79(D22)* 80(D21)* 81(D20)* 82(SYNC_CLK)* 87(D19)* 88(D18)*; IC501 5(SW)* 14(RFOUTB+)* 15(RFOUTB-)* 25(LD)* 30(MUXOUT)*; Y500 1(TRI-STATE)*

### Layout directives
net class RF: AOUT_1, AOUTC_1, NetC519_1, NetC519_2, NetC521_1, NetC521_2

### Notes on the sheet
- Pin 39
- Pin 34
- 16 MHz

### Library data of the parts
C500-C524 = C0603H470J5GACTU: Capacitor; Manufacturer_Name: KEMET; Datasheet Link: https://content.kemet.com/datasheets/KEM_C1001_C0G_200C_SMD.pdf; Height: 0.87mm; Manufacturer_Part_Number: C0603H470J5GACTU
IC500 = AD9914BCPZ: Integrated Circuit; Manufacturer_Name: Analog Devices; Datasheet Link: https://componentsearchengine.com/Datasheets/1/AD9914BCPZ.pdf; Height: 0.9mm; Manufacturer_Part_Number: AD9914BCPZ; Mouser Part Number: 584-AD9914BCPZ; Mouser Price/Stock: https://www.mouser.co.uk/ProductDetail/Analog-Devices/AD9914BCPZ?qs=BpaRKvA4VqHC4wK2pFXfVw%3D%3D; Arrow Part Number: AD9914BCPZ; Arrow Price/Stock: https://www.arrow.com/en/products/ad9914bcpz/analog-devices?region=nac
IC501 = ADF4350BCPZ: Integrated Circuit; Manufacturer_Name: Analog Devices; Datasheet Link: https://datasheet.datasheetarchive.com/originals/distributors/Datasheets-SFU1/DSASFU10004634.pdf; Height: 1mm; Manufacturer_Part_Number: ADF4350BCPZ; Mouser Part Number: 584-ADF4350BCPZ; Mouser Price/Stock: https://www.mouser.co.uk/ProductDetail/Analog-Devices/ADF4350BCPZ?qs=BpaRKvA4VqGt2ZHwONikjQ%3D%3D; Arrow Part Number: ADF4350BCPZ; Arrow Price/Stock: https://www.arrow.com/en/products/adf4350bcpz/analog-devices?region=nac
L500 L501 = AIML-0603-100K-T: Inductor; Manufacturer_Name: ABRACON; Datasheet Link: https://abracon.com/Magnetics/new/AIML-0603.pdf; Height: 0.95mm; Manufacturer_Part_Number: AIML-0603-100K-T; Mouser Part Number: 815-AIML-0603-100KT; Mouser Price/Stock: https://www.mouser.co.uk/ProductDetail/ABRACON/AIML-0603-100K-T?qs=1vO2EIVe%252BY5tBY%252BpVVThrw%3D%3D; Arrow Part Number: AIML-0603-100K-T; Arrow Price/Stock: https://www.arrow.com/en/products/aiml-0603-100k-t/abracon?region=nac
R500-R507 = CR0603-FX-1431ELF: Resistor; Manufacturer_Name: Bourns; Datasheet Link: https://www.bourns.com/pdfs/chpreztr.pdf; Height: 0.55mm; Manufacturer_Part_Number: CR0603-FX-1431ELF; Mouser Part Number: 652-CR0603FX-1431ELF; Mouser Price/Stock: https://www.mouser.co.uk/ProductDetail/Bourns/CR0603-FX-1431ELF?qs=e7cxVwPieurCzASkAzK2%252Bg%3D%3D
Y500 = ECS-3225SMV-160-FP-TR: Crystal or Oscillator; Manufacturer_Name: ECS; Datasheet Link: https://datasheet.datasheetarchive.com/originals/distributors/Datasheets_SAMA/aca54b4a763fa6b74cd8d2921d99cf9f.pdf; Height: 1.2mm; Manufacturer_Part_Number: ECS-3225SMV-160-FP-TR; Mouser Part Number: 520-3225SMV-160-FPT; Mouser Price/Stock: https://www.mouser.co.uk/ProductDetail/ECS/ECS-3225SMV-160-FP-TR?qs=%252B6g0mu59x7IhPTRSFb%2Fsjg%3D%3D; Arrow Part Number: ECS-3225SMV-160-FP-TR; Arrow Price/Stock: https://www.arrow.com/en/products/ecs-3225smv-160-fp-tr/ecs-international?region=nac

## Sheet SINTETIZADOR Y MEZCLADOR.SchDoc
size A4; SheetNumber: 6; SheetTotal: 7
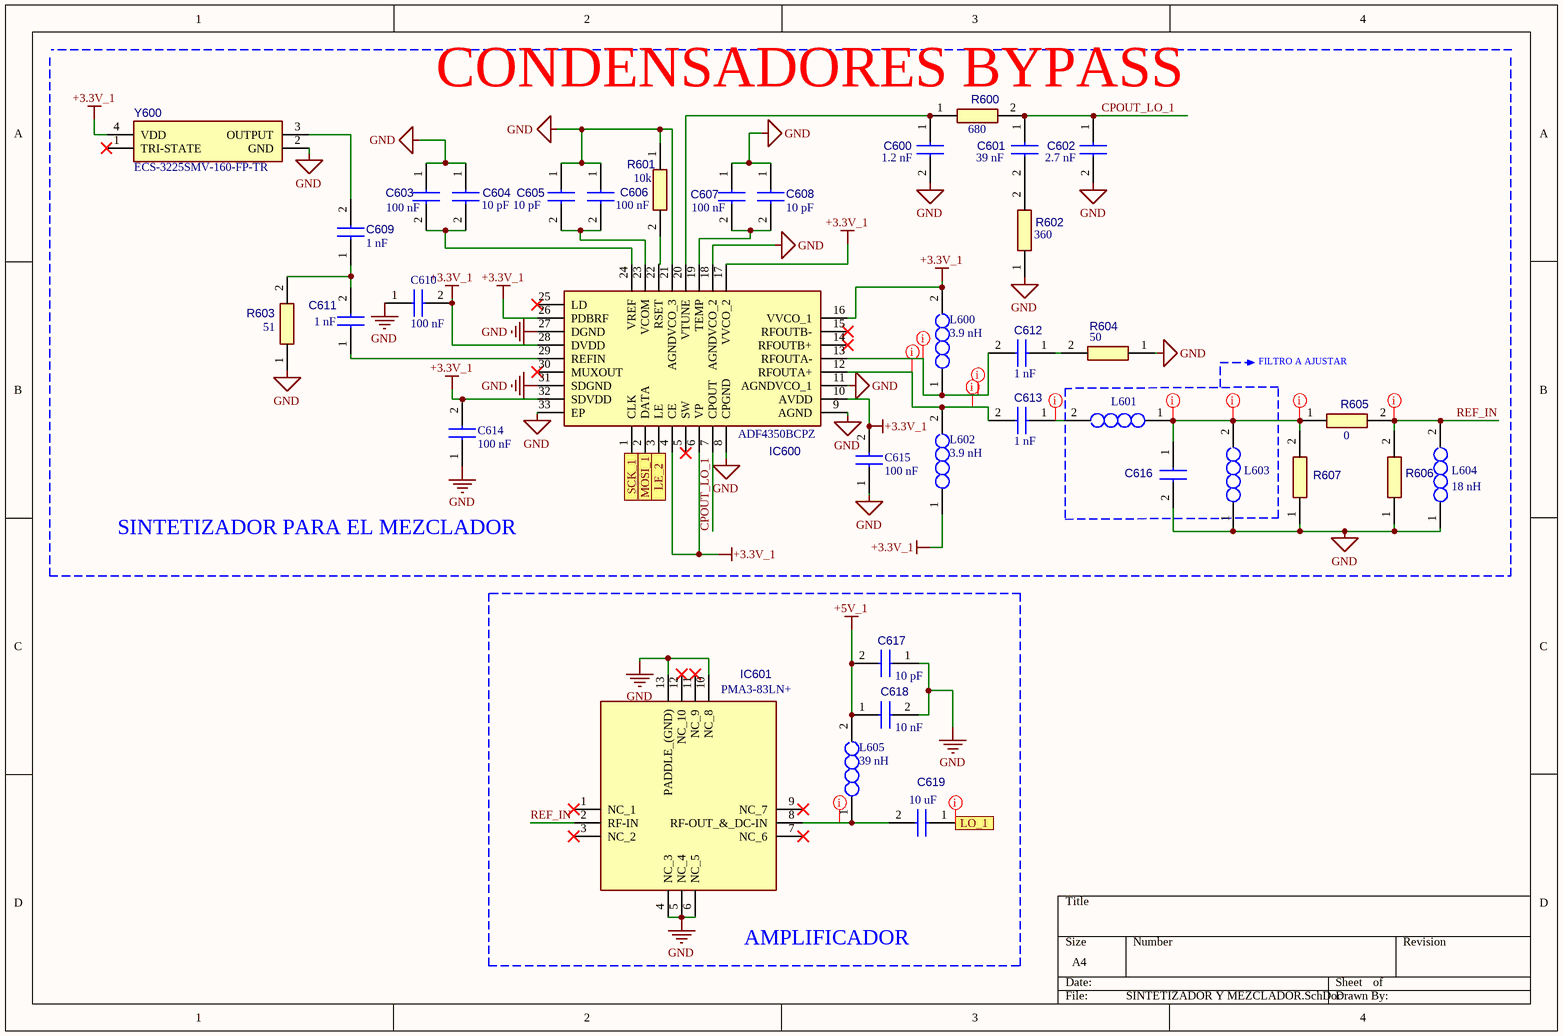
[diagram p3: SINTETIZADOR Y MEZCLADOR.SchDoc]

### Parts
C600  1.2 nF  [C0603]
C601  39 nF  [C0603]
C602  2.7 nF  [C0603]
C603  100 nF  [C0603]
C604  10 pF  [C0603]
C605  10 pF  [C0603]
C606  100 nF  [C0603]
C607  100 nF  [C0603]
C608  10 pF  [C0603]
C609  1 nF  [C0603]
C610  100 nF  [C0603]
C611  1 nF  [C0603]
C612  1 nF  [C0603]
C613  1 nF  [C0603]
C614  100 nF  [C0603]
C615  100 nF  [C0603]
C616  2 pF  [C0603]  (value not drawn)
C617  10 pF  [C0603]
C618  10 nF  [C0603]
C619  10 uF  [C0603]
IC600  ADF4350BCPZ  [QFN50P500X500X100-33N]
IC601  PMA3-83LN+  [QFN51P300X300X89-13N]
L600  3.9 nH  [INDC1608X95N]
L601  3.9 nH  [INDC1608X95N]  (value not drawn)
L602  3.9 nH  [INDC1608X95N]
L603  1.6 nH  [INDC1608X95N]  (value not drawn)
L604  18 nH  [INDC1608X95N]
L605  39 nH  [INDC1608X95N]
R600  680  [RESC1608X55N]
R601  10k  [RESC1608X55N]
R602  360  [RESC1608X55N]
R603  51  [RESC1608X55N]
R604  50  [RESC1608X55N]
R605  0  [RESC1608X55N]
R606  68  [RESC1608X55N]  (value not drawn)
R607  68  [RESC1608X55N]  (value not drawn)
Y600  ECS-3225SMV-160-FP-TR  [ECS3225SMV160FPTR]

### Blocks framed on the sheet
FILTRO A AJUSTAR: C616 L601 L603
AMPLIFICADOR: C617-C619 IC601 L605

### Ports
LE_2 (in), LO_1 (out), MOSI_1, SCK_1

### Nets
+3.3V_1: C610.2 C614.2 C615.2 IC600.4(CE) IC600.6(VP) IC600.10(AVDD) IC600.16(VVCO_1) IC600.17(VVCO_2) IC600.26(PDBRF) IC600.28(DVDD) IC600.32(SDVDD) L600.2 L602.1 Y600.4(VDD)
+5V_1: C617.2 C618.1 L605.2
GND: C600.2 C602.2 C603.1 C604.1 C605.1 C606.1 C607.1 C608.1 C610.1 C614.1 C615.1 C616.2 C617.1 C618.2 IC600.8(CPGND) IC600.9(AGND) IC600.11(AGNDVCO_1) IC600.18(AGNDVCO_2) IC600.21(AGNDVCO_3) IC600.27(DGND) IC600.31(SDGND) IC600.33(EP) IC601.4(NC_3) IC601.5(NC_4) IC601.6(NC_5) IC601.10(NC_8) IC601.13(PADDLE_(GND)) L603.1 L604.1 R601.1 R602.1 R603.1 R604.1 R606.1 R607.1 Y600.2(GND)
CPOUT_LO_1: C601.1 C602.1 IC600.7(CPOUT) R600.2
LE_2: IC600.3(LE) ; port LE_2
MOSI_1: IC600.2(DATA) ; port MOSI_1
REF_IN: IC601.2(RF-IN) L604.2 R605.2 R606.2
SCK_1: IC600.1(CLK) ; port SCK_1
NetC600_1: C600.1 IC600.20(VTUNE) R600.1
NetC601_2: C601.2 R602.2
NetC603_2: C603.2 C604.2 IC600.24(VREF)
NetC605_2: C605.2 C606.2 IC600.23(VCOM)
NetC607_2: C607.2 C608.2 IC600.19(TEMP)
NetC609_1: C609.1 C611.2 R603.2
NetC609_2: C609.2 Y600.3(OUTPUT)
NetC611_1: C611.1 IC600.29(REFIN)
NetC612_1: C612.1 R604.2
NetC612_2: C612.2 IC600.13(RFOUTA-) L600.1
NetC613_1: C613.1 L601.2
NetC613_2: C613.2 IC600.12(RFOUTA+) L602.2
NetC616_1: C616.1 L601.1 L603.2 R605.1 R607.2
NetC619_1: C619.1 ; port LO_1
NetC619_2: C619.2 IC601.8(RF-OUT_&_DC-IN) L605.1
NetIC600_22: IC600.22(RSET) R601.2

Not connected (* = marked no-connect by the designer): IC600 5(SW)* 14(RFOUTB+)* 15(RFOUTB-)* 25(LD)* 30(MUXOUT)*; IC601 1(NC_1)* 3(NC_2)* 7(NC_6)* 9(NC_7)* 11(NC_9)* 12(NC_10)*; Y600 1(TRI-STATE)*

### Layout directives
net class RF: NetC612_2, NetC613_1, NetC613_2, NetC616_1, NetC619_1, NetC619_2, REF_IN

### Notes on the sheet
- (near R600) CONDENSADORES BYPASS
- SINTETIZADOR PARA EL MEZCLADOR

### Library data of the parts
C600-C619 = C0603H470J5GACTU: Capacitor; Manufacturer_Name: KEMET; Datasheet Link: https://content.kemet.com/datasheets/KEM_C1001_C0G_200C_SMD.pdf; Height: 0.87mm; Manufacturer_Part_Number: C0603H470J5GACTU
IC600 = ADF4350BCPZ: as IC501 on sheet SINTETIZADOR Y DDS SLAVE; Datasheet Link: https://datasheet.datasheetarchive.com/originals/distributors/Datasheets-SFU1/DSASFU10004634.pdf; Height: 1mm; Manufacturer_Part_Number: ADF4350BCPZ; Mouser Part Number: 584-ADF4350BCPZ; Mouser Price/Stock: https://www.mouser.co.uk/ProductDetail/Analog-Devices/ADF4350BCPZ?qs=BpaRKvA4VqGt2ZHwONikjQ%3D%3D; Arrow Part Number: ADF4350BCPZ; Arrow Price/Stock: https://www.arrow.com/en/products/adf4350bcpz/analog-devices?region=nac
IC601 = PMA3-83LN+: as IC700 on sheet SALIDA RF; Datasheet Link: https://www.minicircuits.com/pdfs/PMA3-83LN+.pdf; Height: 0.89mm; Manufacturer_Part_Number: PMA3-83LN+; Mouser Part Number: 139-PMA3-83LN; Mouser Price/Stock: https://www.mouser.co.uk/ProductDetail/Mini-Circuits/PMA3-83LN%2b?qs=xZ%2FP%252Ba9zWqbScBj7fhbP6Q%3D%3D
L600-L605 = AIML-0603-100K-T: Inductor; Manufacturer_Name: ABRACON; Datasheet Link: https://abracon.com/Magnetics/new/AIML-0603.pdf; Height: 0.95mm; Manufacturer_Part_Number: AIML-0603-100K-T; Mouser Part Number: 815-AIML-0603-100KT; Mouser Price/Stock: https://www.mouser.co.uk/ProductDetail/ABRACON/AIML-0603-100K-T?qs=1vO2EIVe%252BY5tBY%252BpVVThrw%3D%3D; Arrow Part Number: AIML-0603-100K-T; Arrow Price/Stock: https://www.arrow.com/en/products/aiml-0603-100k-t/abracon?region=nac
R600-R607 = CR0603-FX-1431ELF: Resistor; Manufacturer_Name: Bourns; Datasheet Link: https://www.bourns.com/pdfs/chpreztr.pdf; Height: 0.55mm; Manufacturer_Part_Number: CR0603-FX-1431ELF; Mouser Part Number: 652-CR0603FX-1431ELF; Mouser Price/Stock: https://www.mouser.co.uk/ProductDetail/Bourns/CR0603-FX-1431ELF?qs=e7cxVwPieurCzASkAzK2%252Bg%3D%3D
Y600 = ECS-3225SMV-160-FP-TR: as Y500 on sheet SINTETIZADOR Y DDS SLAVE; Datasheet Link: https://datasheet.datasheetarchive.com/originals/distributors/Datasheets_SAMA/aca54b4a763fa6b74cd8d2921d99cf9f.pdf; Height: 1.2mm; Manufacturer_Part_Number: ECS-3225SMV-160-FP-TR; Mouser Part Number: 520-3225SMV-160-FPT; Mouser Price/Stock: https://www.mouser.co.uk/ProductDetail/ECS/ECS-3225SMV-160-FP-TR?qs=%252B6g0mu59x7IhPTRSFb%2Fsjg%3D%3D; Arrow Part Number: ECS-3225SMV-160-FP-TR; Arrow Price/Stock: https://www.arrow.com/en/products/ecs-3225smv-160-fp-tr/ecs-international?region=nac

## Sheet SLAVE.SchDoc
size A4; SheetNumber: 3; SheetTotal: 7
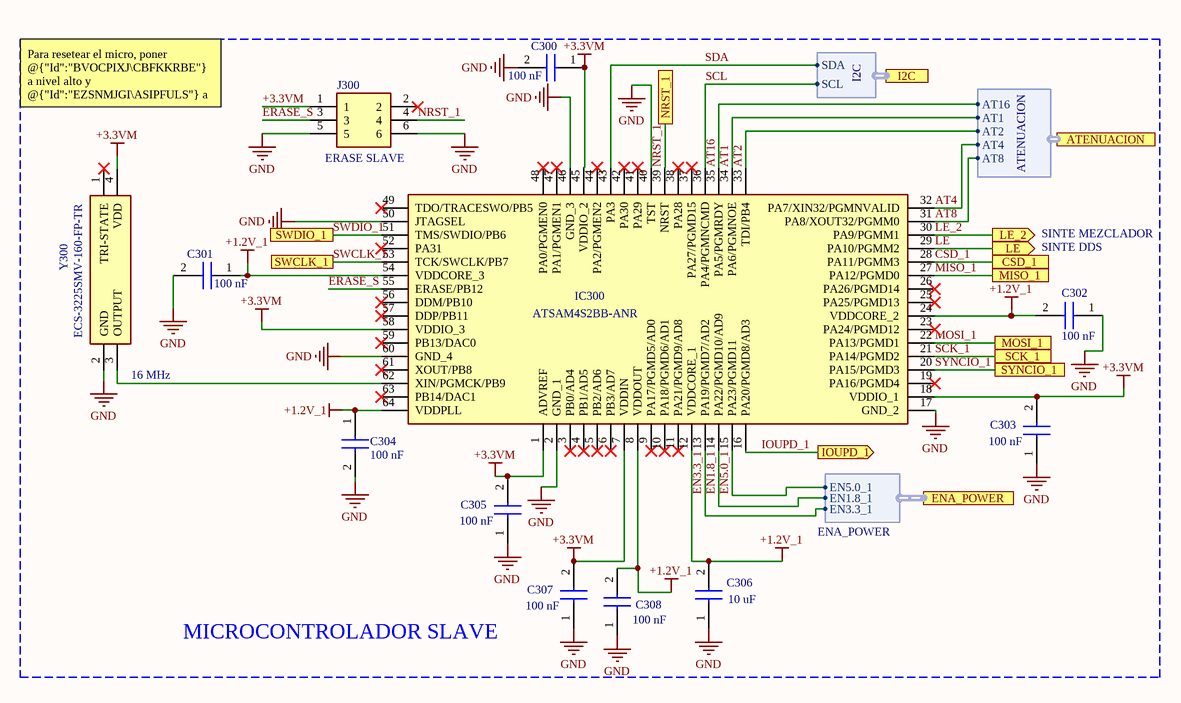
[diagram p4: SLAVE.SchDoc]

### Parts
C300  100 nF  [C0603]
C301  100 nF  [C0603]
C302  100 nF  [C0603]
C303  100 nF  [C0603]
C304  100 nF  [C0603]
C305  100 nF  [C0603]
C306  10 uF  [C0603]
C307  100 nF  [C0603]
C308  100 nF  [C0603]
IC300  ATSAM4S2BB-ANR  [QFN50P905X905X75-65N]
J300  ERASE SLAVE  [HDRV6W64P254_2X3_762X508X889P]
Y300  ECS-3225SMV-160-FP-TR  [ECS3225SMV160FPTR]

### Ports
ATENUACION (harness ATENUACION), CSD_1, ENA_POWER (harness ENA_POWER), I2C (harness I2C), IOUPD_1 (out), LE (out), LE_2 (out), MISO_1, MOSI_1, NRST_1, SCK_1, SWCLK_1, SWDIO_1, SYNCIO_1

### Harnesses
I2C: SDA, SCL
ATENUACION: AT16, AT1, AT2, AT4, AT8
ENA_POWER: EN5.0_1, EN1.8_1, EN3.3_1

### Nets
+1.2V_1: C301.1 C302.2 C304.1 C306.2 C308.2 IC300.8(VDDOUT) IC300.12(VDDCORE_1) IC300.24(VDDCORE_2) IC300.54(VDDCORE_3) IC300.64(VDDPLL)
+3.3VM: C300.1 C303.2 C305.2 C307.2 IC300.1(ADVREF) IC300.7(VDDIN) IC300.18(VDDIO_1) IC300.45(VDDIO_2) IC300.58(VDDIO_3) J300.1 Y300.4(VDD)
GND: C300.2 C301.2 C302.1 C303.1 C304.2 C305.1 C306.1 C307.1 C308.1 IC300.2(GND_1) IC300.17(GND_2) IC300.40(TST) IC300.46(GND_3) IC300.50(JTAGSEL) IC300.60(GND_4) J300.5 J300.6 Y300.2(GND)
AT1: IC300.34(PA6/PGMNOE) ; port ATENUACION.AT1
AT2: IC300.33(TDI/PB4) ; port ATENUACION.AT2
AT4: IC300.32(PA7/XIN32/PGMNVALID) ; port ATENUACION.AT4
AT8: IC300.31(PA8/XOUT32/PGMM0) ; port ATENUACION.AT8
AT16: IC300.35(PA5/PGMRDY) ; port ATENUACION.AT16
CSD_1: IC300.28(PA11/PGMM3) ; port CSD_1
EN1.8_1: IC300.14(PA22/PGMD10/AD9) ; port ENA_POWER.EN1.8_1
EN3.3_1: IC300.13(PA19/PGMD7/AD2) ; port ENA_POWER.EN3.3_1
EN5.0_1: IC300.15(PA23/PGMD11) ; port ENA_POWER.EN5.0_1
ERASE_S: IC300.55(ERASE/PB12) J300.3
IOUPD_1: IC300.16(PA20/PGMD8/AD3) ; port IOUPD_1
LE: IC300.29(PA10/PGMM2) ; port LE
LE_2: IC300.30(PA9/PGMM1) ; port LE_2
MISO_1: IC300.27(PA12/PGMD0) ; port MISO_1
MOSI_1: IC300.22(PA13/PGMD1) ; port MOSI_1
NRST_1: IC300.39(NRST) J300.4 ; port NRST_1
SCK_1: IC300.21(PA14/PGMD2) ; port SCK_1
SCL: IC300.36(PA4/PGMNCMD) ; port I2C.SCL
SDA: IC300.43(PA3) ; port I2C.SDA
SWCLK_1: IC300.53(TCK/SWCLK/PB7) ; port SWCLK_1
SWDIO_1: IC300.51(TMS/SWDIO/PB6) ; port SWDIO_1
SYNCIO_1: IC300.20(PA15/PGMD3) ; port SYNCIO_1
NetIC300_62: IC300.62(XIN/PGMCK/PB9) Y300.3(OUTPUT)

Not connected (* = marked no-connect by the designer): IC300 3(PB0/AD4)* 4(PB1/AD5)* 5(PB2/AD6)* 6(PB3/AD7)* 9(PA17/PGMD5/AD0)* 10(PA18/PGMD6/AD1)* 11(PA21/PGMD9/AD8)* 19(PA16/PGMD4)* 23(PA24/PGMD12)* 25(PA25/PGMD13)* 26(PA26/PGMD14)* 37(PA27/PGMD15)* 38(PA28)* 41(PA29)* 42(PA30)* 44(PA2/PGMEN2)* 47(PA1/PGMEN1)* 48(PA0/PGMEN0)* 49(TDO/TRACESWO/PB5)* 52(PA31)* 56(DDM/PB10)* 57(DDP/PB11)* 59(PB13/DAC0)* 61(XOUT/PB8)* 63(PB14/DAC1)*; J300 2*; Y300 1(TRI-STATE)*

### Notes on the sheet
- Para resetear el micro, poner @{"Id":"BVOCPIXJ\CBFKKRBE"} a nivel alto y @{"Id":"EZSNMJGI\ASIPFULS"} a nivel bajo. En reposo, colocar @{"Id":"BVOCPIXJ\CBFKKRBE"} a nivel bajo y @{"Id":"EZSNMJGI\ASIPFULS"} en vacio.
- SINTE MEZCLADOR
- SINTE DDS
- (near Y300) 16 MHz
- MICROCONTROLADOR SLAVE

### Library data of the parts
C300-C308 = C0603H470J5GACTU: Capacitor; Manufacturer_Name: KEMET; Datasheet Link: https://content.kemet.com/datasheets/KEM_C1001_C0G_200C_SMD.pdf; Height: 0.87mm; Manufacturer_Part_Number: C0603H470J5GACTU
IC300 = ATSAM4S2BB-ANR: Integrated Circuit; Manufacturer_Name: Microchip; Datasheet Link: https://www.arrow.com/en/products/atsam4s2bb-anr/microchip-technology; Height: 1.6mm; Manufacturer_Part_Number: ATSAM4S2BB-ANR; Mouser Part Number: 556-ATSAM4S2BB-ANR; Mouser Price/Stock: https://www.mouser.co.uk/ProductDetail/Microchip-Technology/ATSAM4S2BB-ANR?qs=YCa%2FAAYMW01XwEtU%252BP2dsA%3D%3D; Arrow Part Number: ATSAM4S2BB-ANR; Arrow Price/Stock: https://www.arrow.com/en/products/atsam4s2bb-anr/microchip-technology
J300 = 61300621121: Connector; Manufacturer_Name: Wurth Elektronik; Height: 8.89mm; Manufacturer_Part_Number: 61300621121; Mouser Part Number: 710-61300621121; Mouser Price/Stock: https://www.mouser.co.uk/ProductDetail/Wurth-Elektronik/61300621121?qs=PhR8RmCirEb94hrEcn0AQg%3D%3D
Y300 = ECS-3225SMV-160-FP-TR: as Y500 on sheet SINTETIZADOR Y DDS SLAVE; Datasheet Link: https://datasheet.datasheetarchive.com/originals/distributors/Datasheets_SAMA/aca54b4a763fa6b74cd8d2921d99cf9f.pdf; Height: 1.2mm; Manufacturer_Part_Number: ECS-3225SMV-160-FP-TR; Mouser Part Number: 520-3225SMV-160-FPT; Mouser Price/Stock: https://www.mouser.co.uk/ProductDetail/ECS/ECS-3225SMV-160-FP-TR?qs=%252B6g0mu59x7IhPTRSFb%2Fsjg%3D%3D; Arrow Part Number: ECS-3225SMV-160-FP-TR; Arrow Price/Stock: https://www.arrow.com/en/products/ecs-3225smv-160-fp-tr/ecs-international?region=nac

## Nets that join several sheets
+3.3V_1: SINTETIZADOR Y DDS SLAVE (35 pins), SINTETIZADOR Y MEZCLADOR (14 pins)
+3.3VM: GENERADORA V1.5 (6 pins), SALIDA RF (C711.1 IC704.18 IC704.24 R709#2.1), SLAVE (11 pins)
+5V_1: SALIDA RF (9 pins), SINTETIZADOR Y MEZCLADOR (C617.2 C618.1 L605.2)
GND: GENERADORA V1.5 (17 pins), SALIDA RF (55 pins), SINTETIZADOR Y DDS SLAVE (55 pins), SINTETIZADOR Y MEZCLADOR (36 pins), SLAVE (18 pins)
AOUT_1: SALIDA RF (C702.2), SINTETIZADOR Y DDS SLAVE (IC500.42 R500.1)
AOUTC_1: SALIDA RF (C704.2), SINTETIZADOR Y DDS SLAVE (IC500.41 R501.1)
AT1: SALIDA RF (IC704.23), SLAVE (IC300.34)
AT2: SALIDA RF (IC704.22), SLAVE (IC300.33)
AT4: SALIDA RF (IC704.21), SLAVE (IC300.32)
AT8: SALIDA RF (IC704.20), SLAVE (IC300.31)
AT16: SALIDA RF (IC704.19), SLAVE (IC300.35)
CSD_1: SINTETIZADOR Y DDS SLAVE (IC500.22), SLAVE (IC300.28)
IOUPD_1: SINTETIZADOR Y DDS SLAVE (IC500.86), SLAVE (IC300.16)
LE: SINTETIZADOR Y DDS SLAVE (IC501.3), SLAVE (IC300.29)
LE_2: SINTETIZADOR Y MEZCLADOR (IC600.3), SLAVE (IC300.30)
MISO_1: SINTETIZADOR Y DDS SLAVE (IC500.19), SLAVE (IC300.27)
MOSI_1: SINTETIZADOR Y DDS SLAVE (IC500.20 IC501.2), SINTETIZADOR Y MEZCLADOR (IC600.2), SLAVE (IC300.22)
NetC619_1: SALIDA RF (IC701.10), SINTETIZADOR Y MEZCLADOR (C619.1)
NRST_1: GENERADORA V1.5 (J101.3), SLAVE (IC300.39 J300.4)
SCK_1: SINTETIZADOR Y DDS SLAVE (IC500.21 IC501.1), SINTETIZADOR Y MEZCLADOR (IC600.1), SLAVE (IC300.21)
SWCLK_1: GENERADORA V1.5 (J101.2), SLAVE (IC300.53)
SWDIO_1: GENERADORA V1.5 (J101.1), SLAVE (IC300.51)
SYNCIO_1: SINTETIZADOR Y DDS SLAVE (IC500.18), SLAVE (IC300.20)